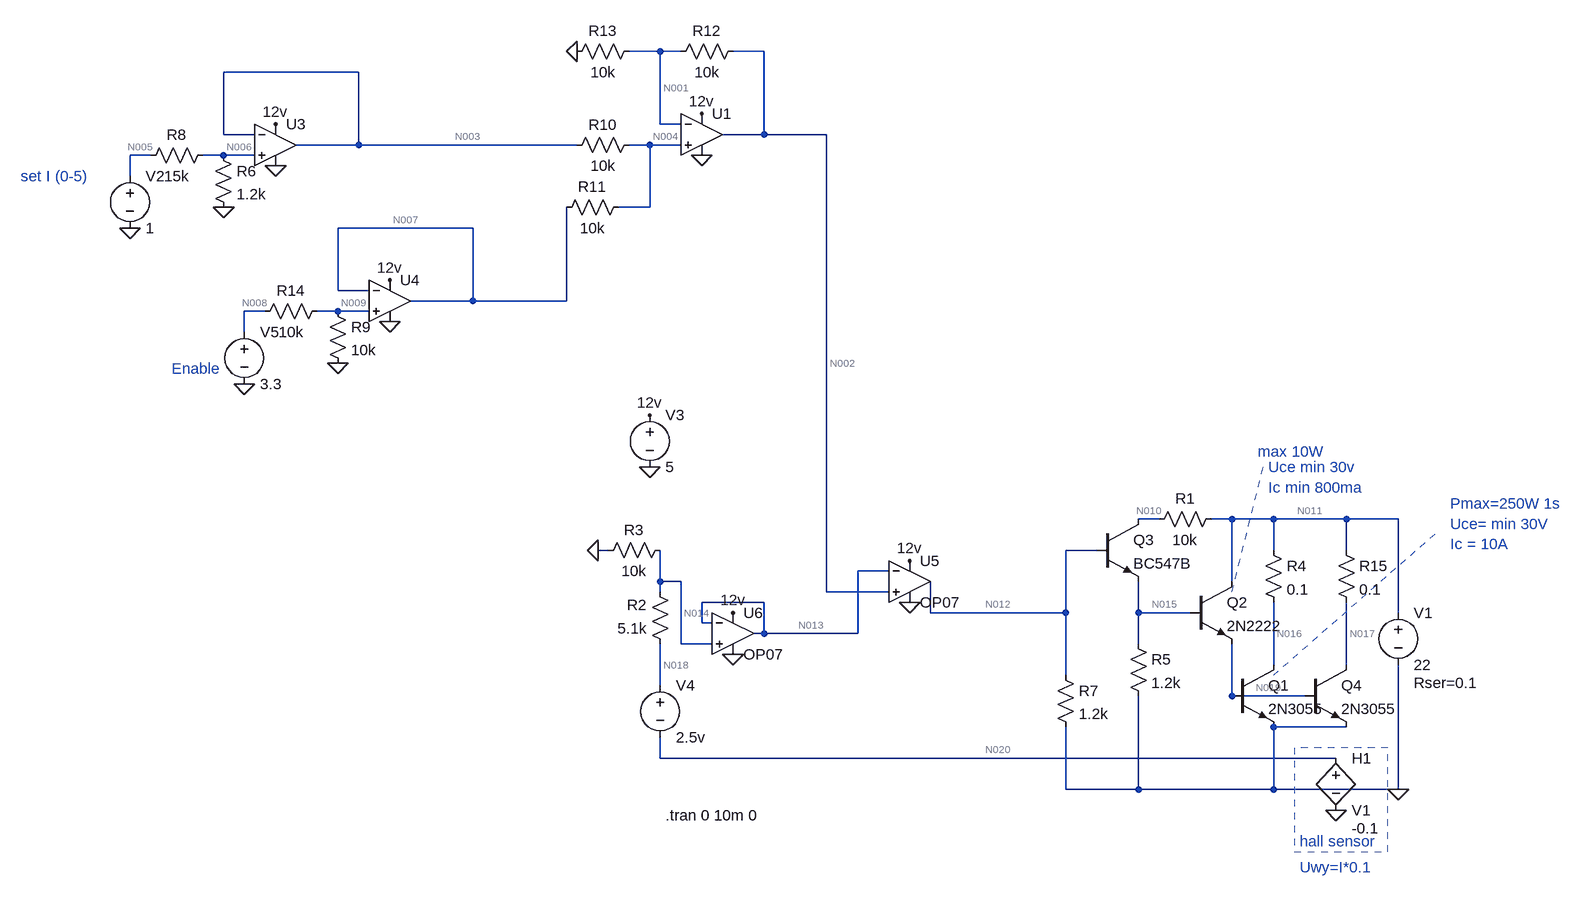
[diagram p0: schematic pomiar_Rw.asc]
pomiar_Rw.asc, the LTspice schematic file:
Version 4
SHEET 1 1612 680
WIRE 208 -736 160 -736
WIRE 240 -736 208 -736
WIRE 368 -736 320 -736
WIRE -256 -704 -464 -704
WIRE 208 -624 208 -736
WIRE 240 -624 208 -624
WIRE -464 -608 -464 -704
WIRE -416 -608 -464 -608
WIRE 368 -608 368 -736
WIRE 368 -608 304 -608
WIRE 464 -608 368 -608
WIRE -256 -592 -256 -704
WIRE -256 -592 -352 -592
WIRE 80 -592 -256 -592
WIRE 192 -592 160 -592
WIRE 240 -592 192 -592
WIRE -576 -576 -608 -576
WIRE -464 -576 -496 -576
WIRE -416 -576 -464 -576
WIRE -608 -544 -608 -576
WIRE 192 -496 192 -592
WIRE 192 -496 144 -496
WIRE -80 -464 -288 -464
WIRE -288 -368 -288 -464
WIRE -240 -368 -288 -368
WIRE -80 -352 -80 -464
WIRE -80 -352 -176 -352
WIRE 64 -352 64 -496
WIRE 64 -352 -80 -352
WIRE -400 -336 -432 -336
WIRE -288 -336 -320 -336
WIRE -240 -336 -288 -336
WIRE -432 -304 -432 -336
WIRE 976 -16 944 -16
WIRE 1088 -16 1056 -16
WIRE 1152 -16 1088 -16
WIRE 1264 -16 1152 -16
WIRE 1344 -16 1264 -16
WIRE 128 32 112 32
WIRE 880 32 832 32
WIRE 1152 32 1152 -16
WIRE 1264 32 1264 -16
WIRE 560 64 512 64
WIRE 208 80 208 32
WIRE 240 80 208 80
WIRE 1088 80 1088 -16
WIRE 208 96 208 80
WIRE 464 96 464 -608
WIRE 560 96 464 96
WIRE 368 112 272 112
WIRE 624 128 624 80
WIRE 832 128 832 32
WIRE 832 128 624 128
WIRE 944 128 944 80
WIRE 1024 128 944 128
WIRE 1344 128 1344 -16
WIRE 272 144 272 112
WIRE 288 144 272 144
WIRE 368 160 368 112
WIRE 368 160 352 160
WIRE 512 160 512 64
WIRE 512 160 368 160
WIRE 240 176 240 80
WIRE 288 176 240 176
WIRE 944 176 944 128
WIRE 1152 208 1152 112
WIRE 1264 208 1264 112
WIRE 832 224 832 128
WIRE 208 240 208 176
WIRE 1088 256 1088 176
WIRE 1200 256 1088 256
WIRE 1264 304 1152 304
WIRE 208 352 208 320
WIRE 1248 352 208 352
WIRE 832 400 832 304
WIRE 944 400 944 256
WIRE 944 400 832 400
WIRE 1152 400 1152 304
WIRE 1152 400 944 400
WIRE 1344 400 1344 208
WIRE 1344 400 1152 400
FLAG 592 112 0
FLAG 192 -96 0
FLAG 192 -176 12v
FLAG 592 48 12v
FLAG 1344 400 0
FLAG 1248 432 0
FLAG 112 32 0
FLAG 320 128 12v
FLAG 320 192 0
FLAG 272 -640 12v
FLAG 272 -576 0
FLAG 80 -736 0
FLAG -608 -464 0
FLAG -384 -624 12v
FLAG -384 -560 0
FLAG -464 -496 0
FLAG -432 -224 0
FLAG -208 -384 12v
FLAG -208 -320 0
FLAG -288 -256 0
SYMBOL voltage 1344 112 R0
WINDOW 123 0 0 Left 0
WINDOW 39 24 124 Left 2
SYMATTR SpiceLine Rser=0.1
SYMATTR InstName V1
SYMATTR Value 22
SYMBOL voltage 192 -192 R0
WINDOW 123 0 0 Left 0
WINDOW 39 0 0 Left 0
SYMATTR InstName V3
SYMATTR Value 5
SYMBOL h 1248 336 R0
WINDOW 123 24 124 Left 2
SYMATTR Value2 -0.1
SYMATTR InstName H1
SYMATTR Value V1
SYMBOL res 816 208 R0
SYMATTR InstName R7
SYMATTR Value 1.2k
SYMBOL res 1072 -32 R90
WINDOW 0 0 56 VBottom 2
WINDOW 3 32 56 VTop 2
SYMATTR InstName R1
SYMATTR Value 10k
SYMBOL res 928 160 R0
SYMATTR InstName R5
SYMATTR Value 1.2k
SYMBOL npn 1088 208 R0
SYMATTR InstName Q1
SYMATTR Value 2N3055
SYMBOL npn 1024 80 R0
SYMATTR InstName Q2
SYMATTR Value 2N2222
SYMBOL npn 880 -16 R0
SYMATTR InstName Q3
SYMATTR Value BC547B
SYMBOL voltage 208 224 R0
WINDOW 123 0 0 Left 0
WINDOW 39 0 0 Left 0
SYMATTR InstName V4
SYMATTR Value 2.5v
SYMBOL res 224 192 R180
WINDOW 0 36 76 Left 2
WINDOW 3 36 40 Left 2
SYMATTR InstName R2
SYMATTR Value 5.1k
SYMBOL res 224 16 R90
WINDOW 0 0 56 VBottom 2
WINDOW 3 32 56 VTop 2
SYMATTR InstName R3
SYMATTR Value 10k
SYMBOL res 336 -752 R90
WINDOW 0 0 56 VBottom 2
WINDOW 3 32 56 VTop 2
SYMATTR InstName R12
SYMATTR Value 10k
SYMBOL res 64 -720 R270
WINDOW 0 32 56 VTop 2
WINDOW 3 0 56 VBottom 2
SYMATTR InstName R13
SYMATTR Value 10k
SYMBOL res 176 -608 R90
WINDOW 0 0 56 VBottom 2
WINDOW 3 32 56 VTop 2
SYMATTR InstName R10
SYMATTR Value 10k
SYMBOL res 160 -512 R90
WINDOW 0 0 56 VBottom 2
WINDOW 3 32 56 VTop 2
SYMATTR InstName R11
SYMATTR Value 10k
SYMBOL voltage -608 -560 R0
WINDOW 123 0 0 Left 0
WINDOW 39 0 0 Left 0
SYMATTR InstName V2
SYMATTR Value 1
SYMBOL res -480 -592 R0
SYMATTR InstName R6
SYMATTR Value 1.2k
SYMBOL res -480 -592 R90
WINDOW 0 0 56 VBottom 2
WINDOW 3 32 56 VTop 2
SYMATTR InstName R8
SYMATTR Value 15k
SYMBOL voltage -432 -320 R0
WINDOW 123 0 0 Left 0
WINDOW 39 0 0 Left 0
SYMATTR InstName V5
SYMATTR Value 3.3
SYMBOL res -304 -352 R0
SYMATTR InstName R9
SYMATTR Value 10k
SYMBOL res -304 -352 R90
WINDOW 0 0 56 VBottom 2
WINDOW 3 32 56 VTop 2
SYMATTR InstName R14
SYMATTR Value 10k
SYMBOL OpAmps\\UniversalOpAmp 272 -608 R0
SYMATTR InstName U1
SYMBOL OpAmps\\UniversalOpAmp -384 -592 R0
SYMATTR InstName U3
SYMBOL OpAmps\\UniversalOpAmp -208 -352 R0
SYMATTR InstName U4
SYMBOL OpAmps\\OP07 592 16 R0
SYMATTR InstName U5
SYMBOL OpAmps\\OP07 320 96 R0
SYMATTR InstName U6
SYMBOL npn 1200 208 R0
SYMATTR InstName Q4
SYMATTR Value 2N3055
SYMBOL res 1136 16 R0
SYMATTR InstName R4
SYMATTR Value 0.1
SYMBOL res 1248 16 R0
SYMATTR InstName R15
SYMATTR Value 0.1
TEXT 216 440 Left 2 !.tran 0 10m 0
TEXT 1192 480 Left 2 ;hall sensor
TEXT 1128 -120 Left 2 ;max 10W
TEXT 1144 -96 Left 2 ;Uce min 30v\nIc min 800ma
TEXT 1424 -40 Left 2 ;Pmax=250W 1s\nUce= min 30V\nIc = 10A
TEXT 1192 520 Left 2 ;Uwy=I*0.1
TEXT -544 -248 Left 2 ;Enable
TEXT -776 -544 Left 2 ;set I (0-5)
LINE Normal 1088 96 1136 -96 2
LINE Normal 1088 96 1088 96 2
LINE Normal 1152 224 1408 0 2
RECTANGLE Normal 1328 336 1184 496 2

The netlist it stands for:
* pomiar_Rw.asc
V1 N011 0 22 Rser=0.1
V3 12v 0 5
H1 N020 0 V1 -0.1
R7 N012 0 1.2k
R1 N011 N010 10k
R5 N015 0 1.2k
Q1 N016 N019 0 0 2N3055
Q2 N011 N015 N019 0 2N2222
Q3 N010 N012 N015 0 BC547B
V4 N018 N020 2.5v
R2 N018 N014 5.1k
R3 N014 0 10k
R12 N002 N001 10k
R13 0 N001 10k
R10 N004 N003 10k
R11 N004 N007 10k
V2 N005 0 1
R6 N006 0 1.2k
R8 N006 N005 15k
V5 N008 0 3.3
R9 N009 0 10k
R14 N009 N008 10k
XU1 N004 N001 12v 0 N002 level1 Avol=1Meg GBW=10Meg Vos=0 En=0 Enk=0 In=0 Ink=0 Rin=500Meg  ; pins In+ In- V+ V- OUT
XU3 N006 N003 12v 0 N003 level1 Avol=1Meg GBW=10Meg Vos=0 En=0 Enk=0 In=0 Ink=0 Rin=500Meg  ; pins In+ In- V+ V- OUT
XU4 N009 N007 12v 0 N007 level1 Avol=1Meg GBW=10Meg Vos=0 En=0 Enk=0 In=0 Ink=0 Rin=500Meg  ; pins In+ In- V+ V- OUT
XU5 N002 N013 12v 0 N012 LT1001  ; OP07, pins In+ In- V+ V- OUT
XU6 N014 N013 12v 0 N013 LT1001  ; OP07, pins In+ In- V+ V- OUT
Q4 N017 N019 0 0 2N3055
R4 N011 N016 0.1
R15 N011 N017 0.1
.model NPN NPN
.model PNP PNP
.lib standard.bjt
.tran 0 10m 0
* hall sensor
* max 10W
* Uce min 30v
* Ic min 800ma
* Pmax=250W 1s
* Uce= min 30V
* Ic = 10A
* Uwy=I*0.1
* Enable
* set I (0-5)
.lib UniversalOpAmp1.lib
.lib LTC.lib
.backanno
.end

* Results of the author's LTspice run, read from the files saved beside the schematic
* Operating Point, zero values left out:
*   V(n011) = 21.9 V
*   V(12v) = 5 V
*   V(n020) = 103.4 mV
*   V(n012) = 1.829 V
*   V(n010) = 11.09 V
*   V(n015) = 1.191 V
*   V(n016) = 21.85 V
*   V(n019) = 456 mV
*   V(n018) = 2.603 V
*   V(n014) = 1.724 V
*   V(n002) = 1.724 V
*   V(n001) = 862.1 mV
*   V(n004) = 862.1 mV
*   V(n003) = 74.08 mV
*   V(n007) = 1.65 V
*   V(n005) = 1 V
*   V(n006) = 74.08 mV
*   V(n008) = 3.3 V
*   V(n009) = 1.65 V
*   V(n013) = 1.724 V
*   V(n017) = 21.85 V
*   Ic(Q1) = 505.9 mA
*   Ib(Q1) = 10.44 mA
*   Ie(Q1) = -516.3 mA
*   Ic(Q4) = 505.9 mA
*   Ib(Q4) = 10.44 mA
*   Ie(Q4) = -516.3 mA
*   Ic(Q2) = 20.78 mA
*   Ib(Q2) = 91.02 µA
*   Ie(Q2) = -20.87 mA
*   Ic(Q3) = 1.08 mA
*   Ib(Q3) = 3.326 µA
*   Ie(Q3) = -1.084 mA
*   I(H1) = -172.4 µA
*   I(R7) = 1.524 mA
*   I(R1) = 1.08 mA
*   I(R5) = 992.7 µA
*   I(R2) = 172.4 µA
*   I(R3) = 172.4 µA
*   I(R12) = 86.2 µA
*   I(R13) = -86.21 µA
*   I(R10) = 78.8 µA
*   I(R11) = -78.79 µA
*   I(R6) = 61.73 µA
*   I(R8) = -61.73 µA
*   I(R9) = 165 µA
*   I(R14) = -165 µA
*   I(R4) = 505.9 mA
*   I(R15) = 505.9 mA
*   I(V1) = -1.034 A
*   I(V3) = -5.328 mA
*   I(V4) = -172.4 µA
*   I(V2) = -61.73 µA
*   I(V5) = -165 µA